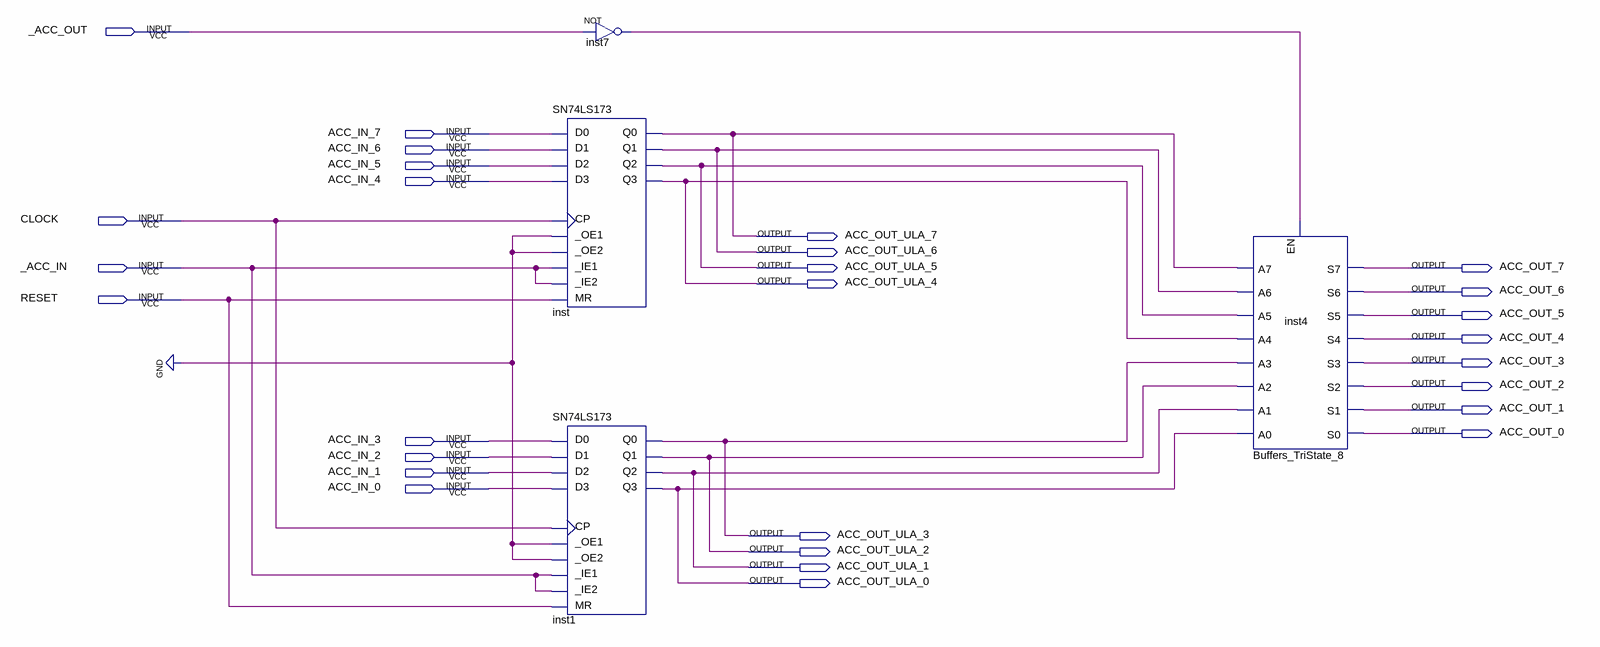
[diagram p0: schematic sheet]
// Quartus schematic ACC.bdf as structural Verilog: 4 symbols, 28 pins
module ACC (
  input  _ACC_OUT,
  input  ACC_IN_7,
  input  ACC_IN_6,
  input  ACC_IN_5,
  input  ACC_IN_4,
  input  CLOCK,
  input  _ACC_IN,
  input  RESET,
  input  ACC_IN_3,
  input  ACC_IN_2,
  input  ACC_IN_1,
  input  ACC_IN_0,
  output ACC_OUT_ULA_7,
  output ACC_OUT_ULA_6,
  output ACC_OUT_ULA_5,
  output ACC_OUT_7,
  output ACC_OUT_ULA_4,
  output ACC_OUT_6,
  output ACC_OUT_5,
  output ACC_OUT_4,
  output ACC_OUT_3,
  output ACC_OUT_2,
  output ACC_OUT_1,
  output ACC_OUT_0,
  output ACC_OUT_ULA_3,
  output ACC_OUT_ULA_2,
  output ACC_OUT_ULA_1,
  output ACC_OUT_ULA_0
);

  wire inst7_out;

  SN74LS173 inst (
    .D0(ACC_IN_7), .D1(ACC_IN_6), .D2(ACC_IN_5), .D3(ACC_IN_4), ._IE1(_ACC_IN), ._IE2(_ACC_IN), .CP(CLOCK),
    .MR(RESET), ._OE1(1'b0), ._OE2(1'b0), .Q0(ACC_OUT_ULA_7), .Q1(ACC_OUT_ULA_6), .Q2(ACC_OUT_ULA_5),
    .Q3(ACC_OUT_ULA_4));
  SN74LS173 inst1 (
    .D0(ACC_IN_3), .D1(ACC_IN_2), .D2(ACC_IN_1), .D3(ACC_IN_0), ._IE1(_ACC_IN), ._IE2(_ACC_IN), .CP(CLOCK),
    .MR(RESET), ._OE1(1'b0), ._OE2(1'b0), .Q0(ACC_OUT_ULA_3), .Q1(ACC_OUT_ULA_2), .Q2(ACC_OUT_ULA_1),
    .Q3(ACC_OUT_ULA_0));
  not inst7 (inst7_out, _ACC_OUT);
  Buffers_TriState_8 inst4 (
    .EN(inst7_out), .A7(ACC_OUT_ULA_7), .A6(ACC_OUT_ULA_6), .A5(ACC_OUT_ULA_5), .A4(ACC_OUT_ULA_4),
    .A3(ACC_OUT_ULA_3), .A2(ACC_OUT_ULA_2), .A1(ACC_OUT_ULA_1), .A0(ACC_OUT_ULA_0), .S7(ACC_OUT_7),
    .S6(ACC_OUT_6), .S5(ACC_OUT_5), .S4(ACC_OUT_4), .S3(ACC_OUT_3), .S2(ACC_OUT_2), .S1(ACC_OUT_1),
    .S0(ACC_OUT_0));
endmodule
